# Altium schematic sheet Battery_charger.SchDoc
size A4; SheetNumber: 1; SheetTotal: 1
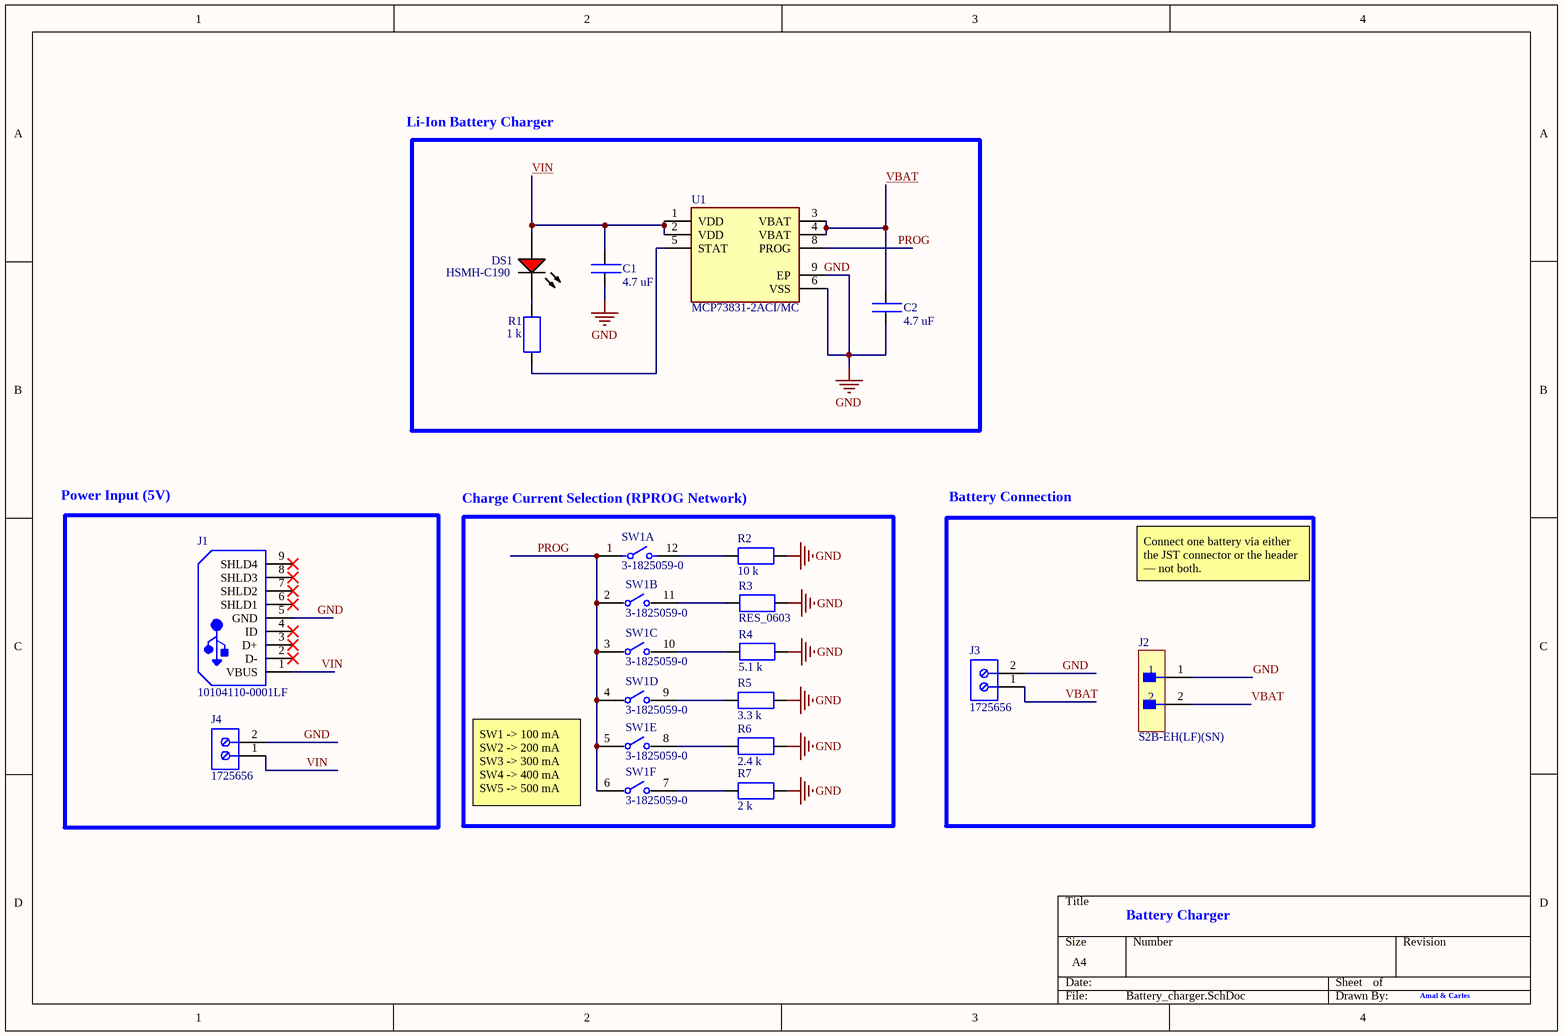
[diagram p0: Battery_charger.SchDoc]

## Parts
C1  4.7 uF  [CAP_0603]
C2  4.7 uF  [CAP_0603]
DS1  HSMH-C190  [HSMH-C190]
J1  10104110-0001LF  [FCI-10104110-0001LF_V]
J2  S2B-EH(LF)(SN)  [FP-S2B-EH_LF_SN-MFG]
J3  1725656  [PHOE-1725656-2]
J4  1725656  [PHOE-1725656-2]
R1  1 k  [RES_0603]
R2  10 k  [RES_0603]
R3  RES_0603  [RES_0603]
R4  5.1 k  [RES_0603]
R5  3.3 k  [RES_0603]
R6  2.4 k  [RES_0603]
R7  2 k  [RES_0603]
SW1  3-1825059-0  [FP-3-1825059-0-MFG]  (parts A,B,C,D,E,F of 6)
U1  MCP73831-2ACI/MC  [SON50P200X300X100-9N]

## Blocks framed on the sheet
Li-Ion Battery Charger: C1 C2 DS1 R1 U1
Charge Current Selection (RPROG Network): R2-R7 SW1

## Nets
GND: C1.1 C2.1 J1.5(GND) J2.1 J3.2 J4.2 R2.2 R3.2 R4.2 R5.2 R6.2 R7.2 U1.6(VSS) U1.9(EP)
PROG: SW1.1 SW1.2 SW1.3 SW1.4 SW1.5 SW1.6 U1.8(PROG)
VBAT: C2.2 J2.2 J3.1 U1.3(VBAT) U1.4(VBAT)
VIN: C1.2 DS1.1(A) J1.1(VBUS) J4.1 U1.1(VDD) U1.2(VDD)
NetDS1_2: DS1.2(K) R1.2
NetR1_1: R1.1 U1.5(STAT)
NetR2_1: R2.1 SW1.12
NetR3_1: R3.1 SW1.11
NetR4_1: R4.1 SW1.10
NetR5_1: R5.1 SW1.9
NetR6_1: R6.1 SW1.8
NetR7_1: R7.1 SW1.7

Not connected (* = marked no-connect by the designer): J1 2(D-)* 3(D+)* 4(ID)* 6(SHLD1)* 7(SHLD2)* 8(SHLD3)* 9(SHLD4)*

## Notes on the sheet
- Power Input (5V)
- Battery Connection
- Connect one battery via either the JST connector or the header — not both.
- (near SW1) SW1 -> 100 mA
  SW2 -> 200 mA
  SW3 -> 300 mA
  SW4 -> 400 mA
  SW5 -> 500 mA
- Battery Charger
- Amal & Carles
- Labels drawn without touching a wire or pin: GND

## Library data of the parts
C1 C2 = CAP_0603: Capacitor SMD 0603 Generic; Manufacturer: YAGEO; Manufacturer Part Number: CC0603KRX7R8BB104; Capacitance: 100 nF; Tolerance: 10%; LCSC Part Number: C92490
DS1 = HSMH-C190: LED Uni-Color Red, 65 mW, 20 mA, -40 to 85 degC, 2-Pin SMD, RoHS, Tape and Reel; Connector Type: USB; Gender: Male; Current Rating: 1 A; Length: 7.5 mm; Lead Pitch: 0.65 mm; PackageReference: HSMX-C190; Package Quantity: 2000; Max Operating Temperature: 85 degC; PackageDescription: 2-Pin Surface Mount Device, Body 1.6 x 0.8 mm, Height 0.9 mm; ComponentLink3Description: Package Specification; Mount: Surface Mount; Min Operating Temperature: -30 degC; ComponentLink3URL: http://www.fairchildsemi.com/dwg/MA/MA03D.pdf; ComponentLink1Description: Manufacturer URL; Contact Material: Copper; Pins: 5; Width: 5.6 mm; ComponentLink2Description: Datasheet; RoHSCompliant: true; DatasheetVersion: Mar-12; Height: 2.8 mm; Packaging: Tape and Reel; Contact Plating: Gold; ComponentLink1URL: http://www.avagotech.com/; REACH SVHC: No SVHC; ComponentLink2URL: http://docs.avagotech.com/docs/AV02-0551EN
J1 = CMP-2000-05823-1: Micro USB, Receptacle, -55 to 85 degC, 5-Pin SMD, RoHS, Tape and Reel; Manufacturer: FCI Electronics; Connector Type: USBMicroB; Contact Termination: SurfaceMountRightAngle; Connector Mounting: PCB; No. of Contacts: 5; Manufacturer URL: http://portal.fciconnect.com/; Contact Plating: Gold; Package Description: 5-Pin Surface Mount Device, Body 8.06 x 5.6 mm, Pitch 0.65 mm; Datasheet URL: http://portal.fciconnect.com/Comergent//fci/drawing/10104110.pdf; Datasheet Version: Rev. C, 03/2011; Package Reference: 10104110-0001LF; Mounting Technology: SurfaceMount; Gender: Receptacle
J2 = CMP-00504-00248789-1: S2B-EH(LF)(SN) Board Connector, 2 Contact(s), 1 Row(s), Male, Right Angle, Solder Terminal, ROHS COMPLIANT; NexarPartId: 248789; Max Voltage Rating (AC): 250V; Pitch: 2.5mm; Connector Type: Male Pin; Contact Resistance: 20mΩ; Number of Contacts: 2; Max Current Rating: 3A; RoHS: Compliant; Termination: Press-Fit; Mount: Through Hole; Housing Color: White; Min Operating Temperature: -25°C; Voltage Rating: 250V; Contact Material: Brass; Max Operating Temperature: 85°C; REACH SVHC: No SVHC; Length: 7.5mm; Width: 8.2mm; Gender: Male; Height: 4.2mm; Number of Positions: 2; Contact Plating: Tin; Depth: 8.2mm; Number of Rows: 1; Fastening Type: Latch; Current Rating: 3A; Orientation: Right Angle; Lead Pitch: 2.5mm; Contact Mating Length: 3.9878mm; Packaging: Bulk; Housing Material: Nylon; Lead Free: Lead Free
J3 J4 = CMP-2000-05299-1: Male Header, Pitch 2.54 mm, 1 x 2 Position, Height 9 mm, Tail Length 3.5 mm; Manufacturer: Phoenix Contact; Number of contacts: 2; Content: 250pc(s); Pitch: 2.54mm; Industrial packaging: Yes; Colour: Green; Manufacturer part No.: 1725656; Type: MPT0,5/2-2,54; Datasheet URL: http://datasheet.octopart.com/1725656-Phoenix-Contact-datasheet-5302866.pdf; Manufacturer URL: http://www.phoenixcontact.com/; Datasheet Version: Apr-08
R1-R7 = RES_0603: Resistor SMD 0603 Generic; Manufacturer: YAGEO; Manufacturer Part Number: NT0603BRD0711K1L; Tolerance: 0.1%; Resistance: 11.1 kOhm; LCSC Part Number: C5197511
SW1 = CMP-03400-000026-1: SWITCH SLIDE DIP SPST 100MA 24V; Actuator Material: Polyamide; Voltage Rating (DC): 5V; Actuator Type: Standard; Number of Positions: 6; Body Material: Polyphenylene; Contact Resistance: 50mR; Sealable: Yes (With); Actuator Length: 0mm; Washable: Yes; Mechanical Life: 1000Cycles; Contact Current Rating: 1A; Pitch: 0.1inch; RoHS Compliant: Yes; Housing Color: Black; Contact Material: Copper Alloy; Mount: Surface Mount; Contact Plating: Gold; Length: 17.22mm; Flammability Rating: UL94 V-0; Orientation: Straight; Package Quantity: 750; Packaging: Tape and Reel; Type: Switch; Depth: 9.3mm; Max Current Rating: 100mA; Terminal Pitch: 2.54mm; Max Voltage Rating (DC): 24V; Min Operating Temperature: -30°C; Radiation Hardening: No; ELV: Compliant; Termination: Gull Wing; Throw Configuration: SPST; Housing Material: Polyphenylene; Lead Free: Lead Free; Max Operating Temperature: 85°C; Height: 0.138inch; Electrical Life: 1000Cycles; Series: ADF, Alcoswitch
U1 = MCP73831-2ACI/MC: Charge Controller Li-Ion/Li-Pol 15mA to 500mA 4.2V 8-Pin DFN EP | Microchip Technology Inc. MCP73831-2ACI/MC; SnapEDA_Link: https://www.snapeda.com/parts/MCP73831-2ACI/MC/Microchip/view-part/?ref=snap; Package: VFDFN-8 Microchip; Value: *; MF: Microchip; MP: MCP73831-2ACI/MC; Check_prices: https://www.snapeda.com/parts/MCP73831-2ACI/MC/Microchip/view-part/?ref=eda